# Altium project CentralUnit.PrjPcb
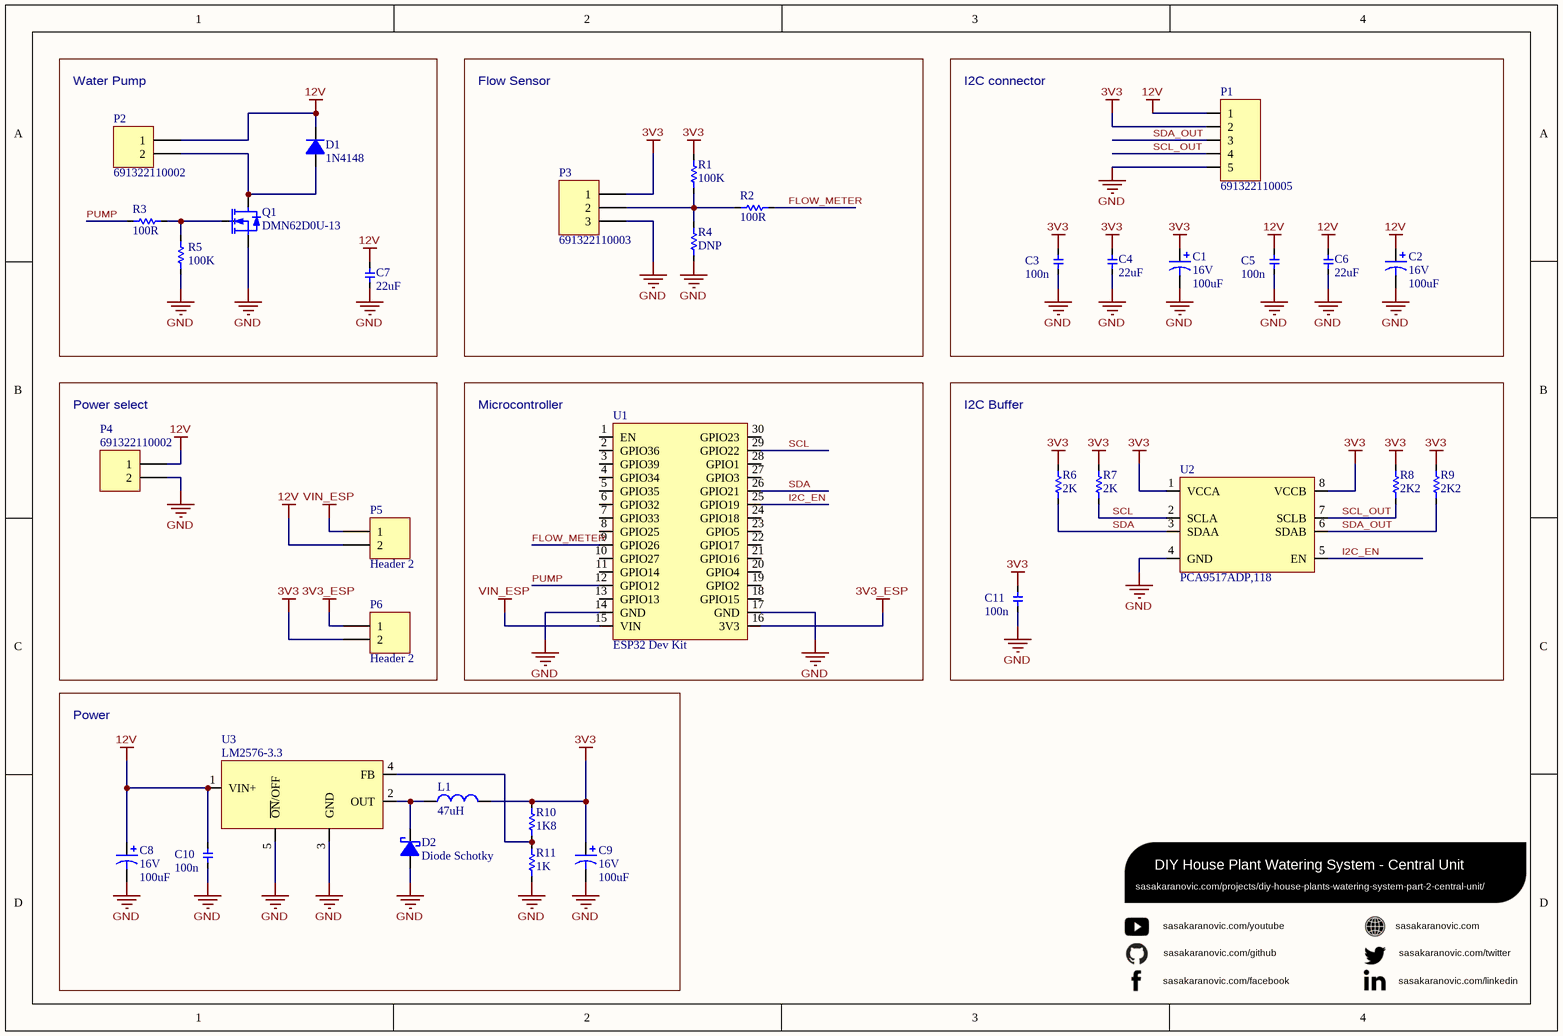
[diagram p0: CentralUnit_Schematic.SchDoc]
1 sheet, 35 parts. Net scope: global (net labels, ports and power ports of the same name join across sheets).
Board file: CentralUnit_PCB.PcbDoc

## Sheet CentralUnit_Schematic.SchDoc: DIY House Plant Watering System - Central Unit
size A4; URL: sasakaranovic.com/projects/diy-house-plants-watering-system-part-2-central-unit/; Distributor: DigiKey

### Parts
C1  16V  value 100uF  [Electrolytic Cap 2.54mm]
C2  16V  value 100uF  [Electrolytic Cap 2.54mm]
C3  value 100n  [0603 - CAP HS]  (hidden comment: Cap)
C4  value 22uF  [0603 - CAP HS]  (hidden comment: Cap)
C5  value 100n  [0603 - CAP HS]  (hidden comment: Cap)
C6  value 22uF  [0603 - CAP HS]  (hidden comment: Cap)
C7  value 22uF  [0603 - CAP HS]  (hidden comment: Cap)
C8  16V  value 100uF  [Electrolytic Cap 2.54mm]
C9  16V  value 100uF  [Electrolytic Cap 2.54mm]
C10  value 100n  [0603 - CAP HS]  (hidden comment: Cap)
C11  value 100n  [0603 - CAP HS]  (hidden comment: Cap)
D1  1N4148  [SOD123F]
D2  Diode Schotky  [1206 Polarized]
L1  value 47uH  [IND_TH_SMD]  (hidden comment: Inductor)
P1  691322110005  [TERMINAL_5POS_90DEG_2PART]
P2  691322110002  [TERMINAL_2POS_90DEG_2PART]
P3  691322110003  [TERMINAL_3POS_90DEG_2PART]
P4  691322110002  [TERMINAL_2POS_90DEG_2PART]
P5  Header 2  [Header 2x1]
P6  Header 2  [Header 2x1]
Q1  DMN62D0U-13  [SOT90P240X100-3N]
R1  value 100K  [0603 - HS]  (hidden comment: Res)
R2  value 100R  [0603 - HS]  (hidden comment: Res)
R3  value 100R  [0603 - HS]  (hidden comment: Res)
R4  value DNP  [0603 - HS]  (hidden comment: Res)  (no BOM)
R5  value 100K  [0603 - HS]  (hidden comment: Res)
R6  value 2K  [0603 - HS]  (hidden comment: Res)
R7  value 2K  [0603 - HS]  (hidden comment: Res)
R8  value 2K2  [0603 - HS]  (hidden comment: Res)
R9  value 2K2  [0603 - HS]  (hidden comment: Res)
R10  value 1K8  [0603 - HS]  (hidden comment: Res)
R11  value 1K  [0603 - HS]  (hidden comment: Res)
U1  ESP32 Dev Kit  [ESP32-DevModule]
U2  PCA9517ADP,118  [MSOP8-3mm]
U3  LM2576-3.3  [TO263-5]

### Blocks framed on the sheet
Water Pump: C7 D1 P2 Q1 R3 R5
Flow Sensor: P3 R1 R2 R4
I2C connector: C1-C6 P1
Power select: P4-P6
Microcontroller: U1
I2C Buffer: C11 R6-R9 U2
Power: C8-C10 D2 L1 R10 R11 U3

### Nets
3V3: C1.1 C3.2 C4.2 C9.1 C11.2 L1.2 P1.2 P3.1 P6.2 R1.2 R6.2 R7.2 R8.2 R9.2 R10.1 U2.1(VCCA) U2.8(VCCB)
3V3_ESP: P6.1 U1.16(3V3)
12V: C2.1 C5.2 C6.2 C7.2 C8.1 C10.2 D1.K P1.1 P2.1 P4.1 P5.2 U3.1(VIN+)
GND: C1.2 C2.2 C3.1 C4.1 C5.1 C6.1 C7.1 C8.2 C9.2 C10.1 C11.1 D2.A P1.5 P3.3 P4.2 Q1.2(S) R4.1 R5.1 R11.2 U1.14(GND) U1.17(GND) U2.4(GND) U3.3(GND) U3.5(~{ON}/OFF)
VIN_ESP: P5.1 U1.15(VIN)
FLOW_METER: R2.2 U1.9(GPIO26)
I2C_EN: U1.25(GPIO19) U2.5(EN)
PUMP: R3.1 U1.12(GPIO12)
SCL: R7.1 U1.29(GPIO22) U2.2(SCLA)
SCL_OUT: P1.4 R8.1 U2.7(SCLB)
SDA: R6.1 U1.26(GPIO21) U2.3(SDAA)
SDA_OUT: P1.3 R9.1 U2.6(SDAB)
NetD1_A: D1.A P2.2 Q1.3(D)
NetD2_K: D2.K L1.1 U3.2(OUT)
NetP3_2: P3.2 R1.1 R2.1 R4.2
NetQ1_1: Q1.1(G) R3.2 R5.2
NetR10_2: R10.2 R11.1 U3.4(FB)

Not connected (* = marked no-connect by the designer): U1 1(EN) 2(GPIO36) 3(GPIO39) 4(GPIO34) 5(GPIO35) 6(GPIO32) 7(GPIO33) 8(GPIO25) 10(GPIO27) 11(GPIO14) 13(GPIO13) 18(GPIO15) 19(GPIO2) 20(GPIO4) 21(GPIO16) 22(GPIO17) 23(GPIO5) 24(GPIO18) 27(GPIO3) 28(GPIO1) 30(GPIO23)

### Notes on the sheet
- sasakaranovic.com/youtube
- sasakaranovic.com
- sasakaranovic.com/github
- sasakaranovic.com/facebook
- sasakaranovic.com/twitter
- sasakaranovic.com/linkedin

### Library data of the parts
C1 C2 C8 C9 = Cap Electrolytic: Polarized Capacitor (Axial); Manufacturer: Nichicon; Manufacturer Part Number: UKT1V101MED1TD; Distributor: DigiKey; Distributor Part Number: 493-10673-1-ND
C3 C5 C10 C11 = Cap: CAP CER 0.1UF 50V X7R 0603; Manufacturer: Samsung Electro-Mechanics; Manufacturer Part Number: CL10B104KB8NNNL; Distributor Part Number: 1276-CL10B104KB8NNNLCT-ND; Distributor: DigiKey
C4 C6 C7 = Cap: Capacitor; Manufacturer: Nichicon; Manufacturer Part Number: UVZ1J220MDD1TD; Distributor Part Number: 493-13481-1-ND; Distributor: DigiKey
D1 = Diode: DIODE GEN PURP 100V 300MA SOD123; Manufacturer: Diodes Incorporated; Manufacturer Part Number: 1N4148W-7-F; Distributor: DigiKey; Distributor Part Number: 1N4148W-FDICT-ND
D2 = Diode Schotky: Manufacturer: AVX Corporation; Manufacturer Part Number: SD1206S040S1R0; Distributor: DigiKey; Distributor Part Number: 478-7805-1-ND
L1 = Inductor: Shielded - Inductor 200mOhm Nonstandard; Manufacturer: Laird-Signal Integrity Products; Manufacturer Part Number: TYS6045470M-10; Distributor: DigiKey; Distributor Part Number: 240-2745-2-ND
P1 = Terminal 5_691322110005: TERM BLOCK HDR 5POS 90DEG 3.5MM; Manufacturer: Würth Elektronik; Distributor: DigiKey; Distributor Part Number: 732-2772-ND; Manufacturer Part Number: 691322110005
P2 P4 = Terminal 2_691322110002: 2 Position Terminal Block Header, Male Pins, Shrouded (4 Side) 0.138" (3.50mm) 90°, Right Angle - Through Hole; Manufacturer: Würth Elektronik; Manufacturer Part Number: 691322110002; Distributor: DigiKey; Distributor Part Number: 732-2769-ND
P3 = Terminal 3_691322110003_1: TERM BLOCK HDR 3POS 90DEG 3.5MM; Manufacturer: Würth Elektronik; Manufacturer Part Number: 691322110003; Distributor: DigiKey; Distributor Part Number: 732-2770-ND
P5 P6 = Header 2: Header, 2-Pin; Manufacturer: Harwin Inc.; Manufacturer Part Number: M20-9960245; Distributor: DigiKey; Distributor Part Number: 952-2244-ND
Q1 = DMN62D0U-13: MOSFET N-CH 60V 0.38A; Manufacturer: Diodes Incorporated; Manufacturer Part Number: DMN62D0U-13; Distributor: DigiKey; Distributor Part Number: DMN62D0U-13DICT-ND
R1-R4 R6-R9 = Res: RES SMD 0 OHM JUMPER 1/10W 0603; Manufacturer: Yageo; Manufacturer Part Number: AC0603JR-070RL; Distributor: DigiKey; Distributor Part Number: 311-0.0LECT-ND
R5 = Res: RES SMD 1M OHM 5% 1/10W 0603; Manufacturer: Yageo; Manufacturer Part Number: RC0603JR-071ML; Distributor: DigiKey; Distributor Part Number: 311-1.0MGRCT-ND
R10 = Res: Resistor; Manufacturer: Yageo; Manufacturer Part Number: RC0603JR-071K8L; Distributor: DigiKey; Distributor Part Number: 311-1.8KGRCT-ND
R11 = Res: Resistor; Manufacturer: Yageo; Manufacturer Part Number: RC0603JR-071KL; Distributor: DigiKey; Distributor Part Number: 311-1.0KGRCT-ND
U1 = ESP32_DEV: Manufacturer: Espressif; Manufacturer Part Number: ESP32-Dev Module; Distributor: TBD; Distributor Part Number: TBD
U2 = PCA9517ADP,118: IC REDRIVER I2C 1CH 8TSSOP; Manufacturer: NXP USA Inc.; Manufacturer Part Number: PCA9517ADP,118; Distributor Part Number: 568-5926-1-ND; Distributor: DigiKey
U3 = LM2576-xx: Buck Switching Regulator IC Positive Fixed 3.3V 1 Output 3A TO-263-6, D²Pak (5 Leads + Tab), TO-263BA; Manufacturer: Texas Instruments; Manufacturer Part Number: LM2596S-3.3/NOPB; Distributor: DigiKey; Distributor Part Number: LM2596S-3.3/NOPB-ND